# Altium project ee_453_yourname.PrjPcb
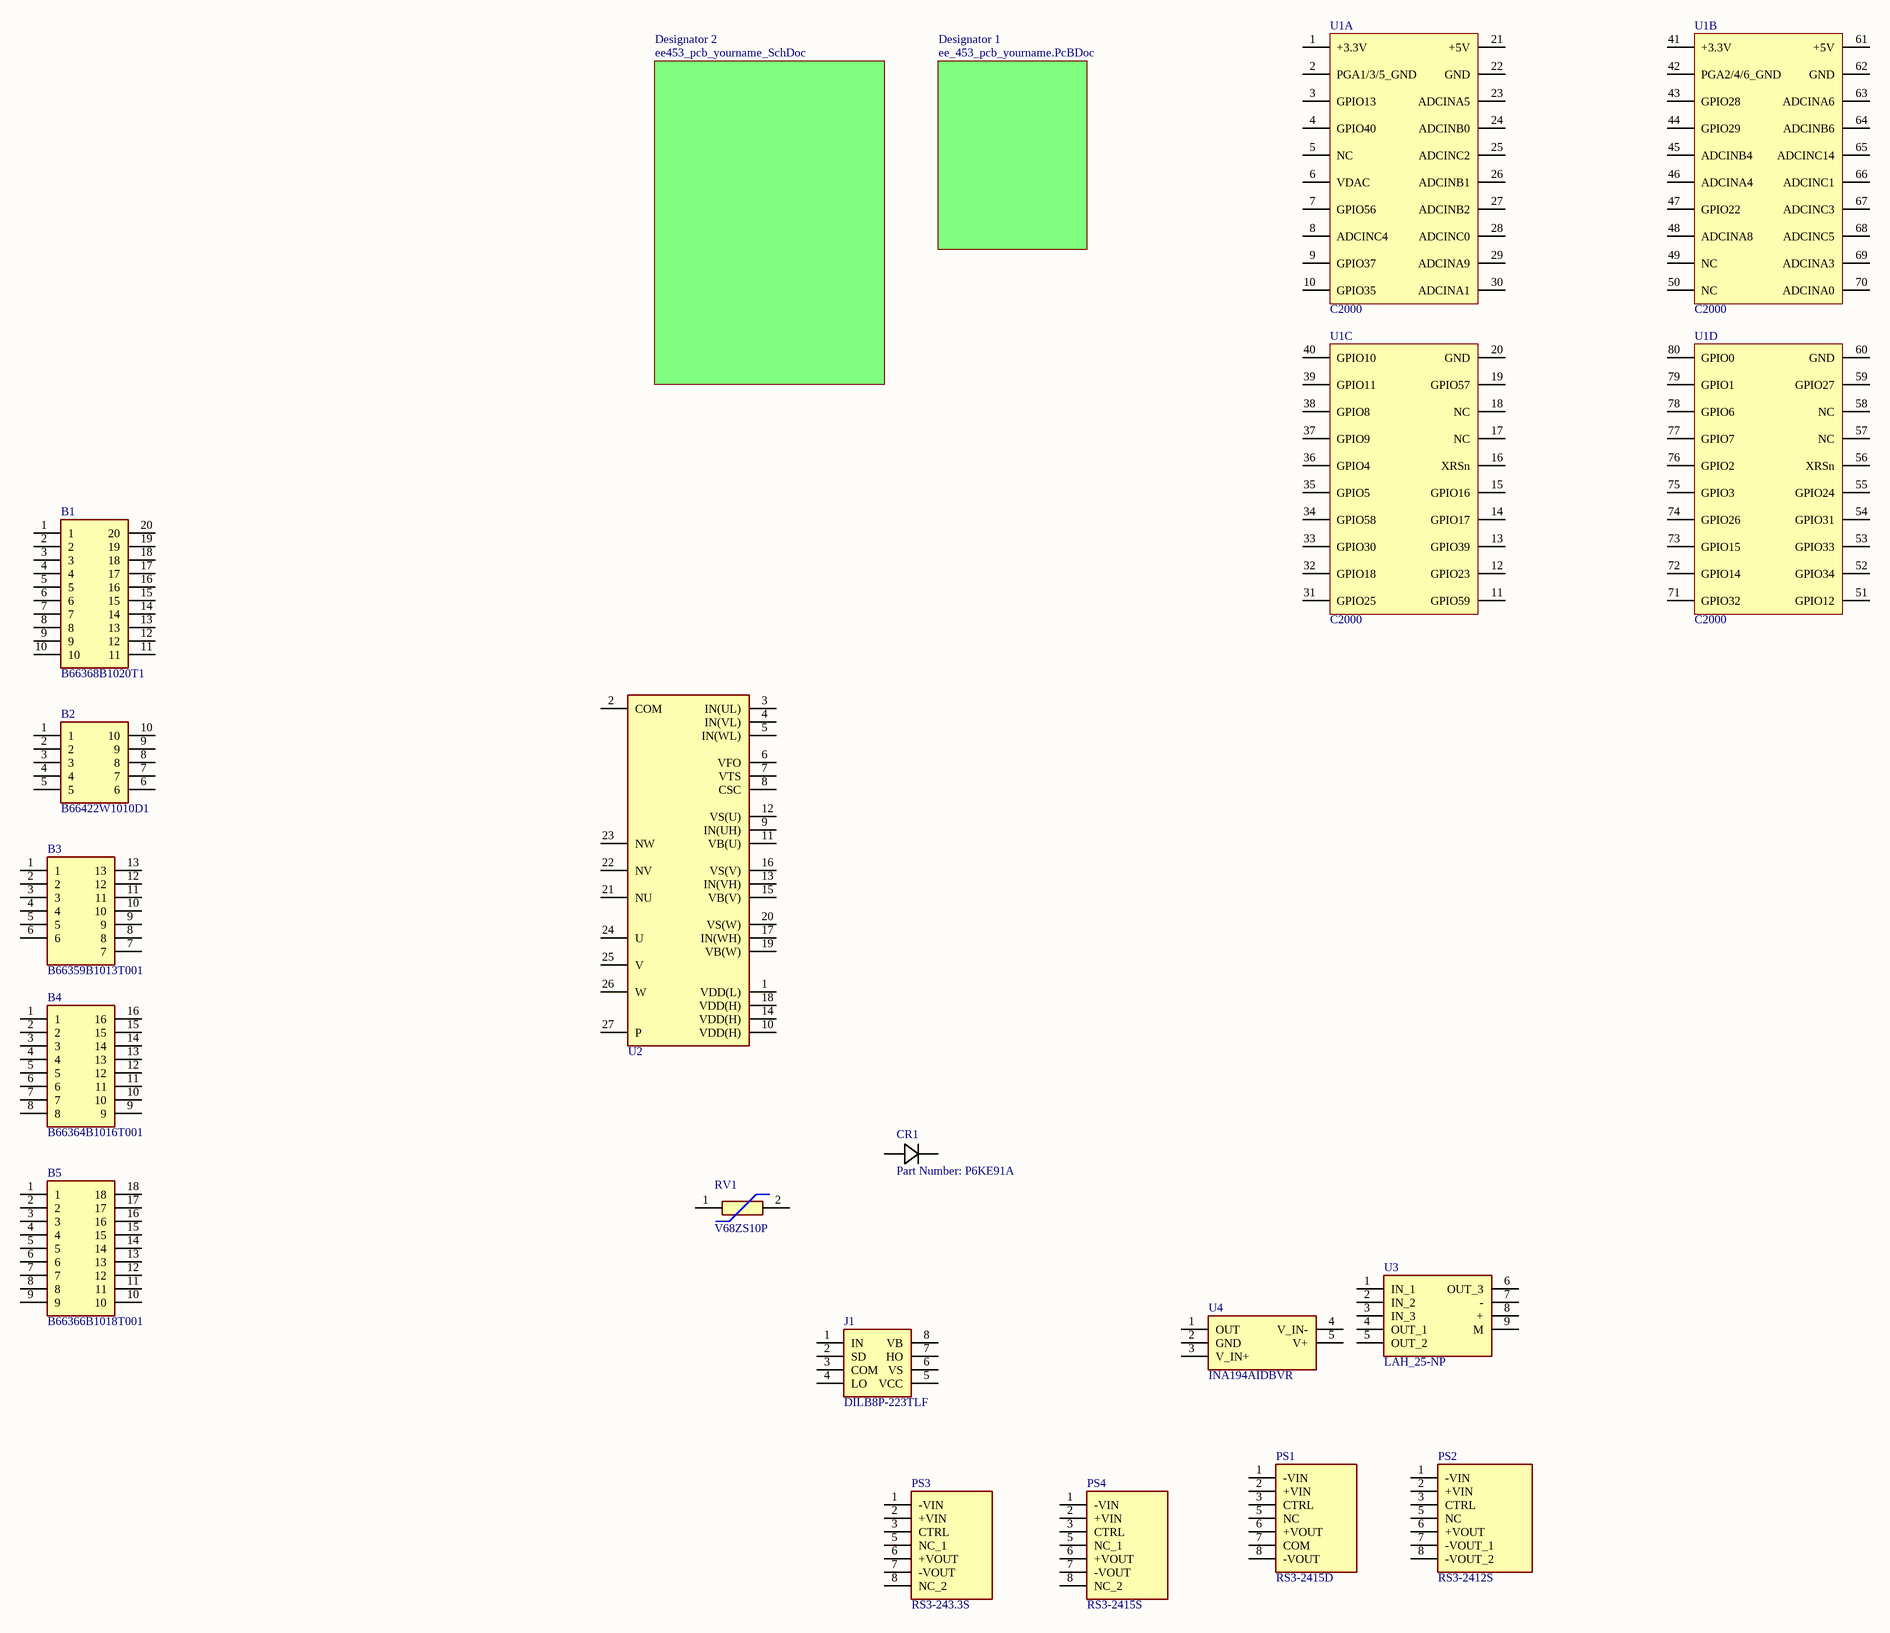
[diagram p0: ee453_pcb_yourname.SchDoc]
10 sheets, 95 parts. Net scope: hierarchical (ports join the sheet entries above them; power ports are global).
Board file: ee453_pcb_yourname.PcbDoc
Sheets:
  ee453_pcb_yourname.SchDoc
  Top_Level.SchDoc
    Power Sources = Power_Sources.SchDoc
    Current Sensor = Current_Sensor.SchDoc
    Boost Converter = Boost.SchDoc
      Inner Boost = Inner_Boost.SchDoc
    Power Module = Power_Module.SchDoc
      DSP = DSP.SchDoc
    Hall Sensors = Hall_Sensors.SchDoc
    DSP - Launchpad = DSP.SchDoc
  levelshifter_page.SchDoc

## Sheet ee453_pcb_yourname.SchDoc: EE 453 Capstone
size C; ApprovedBy: Your Name; CheckedBy: Your Name; Author: Your Name; CompanyName: Dept. of Elec. and Comp. Engg.; DrawnBy: Your Name; Engineer: Your Nmae; Organization: UW-Seattle; Address1: 185 Stevens Way; Address2: Paul Allen Center; Address3: Seattle, WA; Address4: US-98195; DocumentNumber: 1; Revision: 1.0; SheetNumber: 1; SheetTotal: 1

### Parts
(Parts that share a designator on the sheet are numbered #1, #2 ... from top to bottom, then left to right.)
B1  B66368B1020T1  [B66368B1020T1]
B2  B66422W1010D1  [B66422W1010D1]
B3  B66359B1013T001  [B66359B1013T001]
B4  B66364B1016T001  [B66364B1016T001]
B5  B66366B1018T001  [B66366B1018T001]
CR1  Part Number: P6KE91A  [P6KESeries]
J1#1  DILB8P-223TLF  [DIPS762W60P254L1016H525Q8N]
PS1#1  RS3-2415D  [RS32405DH3]
PS2#1  RS3-2412S  [RS32415S]
PS3#1  RS3-243.3S  [RS32433S]
PS4#1  RS3-2415S  [RS32415S]
RV1#1  V68ZS10P  [V68ZS10P]
U1#1  C2000  [C2000]  (parts A,B,C,D of 4)
U2  FNB34060T  [FNB34060T]  (value not drawn)
U3  LAH_25-NP  [LAH-25-NP]
U4  INA194AIDBVR  [SOT95P280X145-5N]

### Sub-sheets
Designator 1 = ee_453_pcb_yourname.PcBDoc (file not in this document): no entries
Designator 2 = ee453_pcb_yourname_SchDoc (file not in this document): no entries

### Nets

Not connected (* = marked no-connect by the designer): B1 1 2 3 4 5 6 7 8 9 10 11 12 13 14 15 16 17 18 19 20; B2 1 2 3 4 5 6 7 8 9 10; B3 1 2 3 4 5 6 7 8 9 10 11 12 13; B4 1 2 3 4 5 6 7 8 9 10 11 12 13 14 15 16; B5 1 2 3 4 5 6 7 8 9 10 11 12 13 14 15 16 17 18; CR1 1 2; J1#1 1(IN) 2(SD) 3(COM) 4(LO) 5(VCC) 6(VS) 7(HO) 8(VB); PS1#1 1(-VIN) 2(+VIN) 3(CTRL) 5(NC) 6(+VOUT) 7(COM) 8(-VOUT); PS2#1 1(-VIN) 2(+VIN) 3(CTRL) 5(NC) 6(+VOUT) 7(-VOUT_1) 8(-VOUT_2); PS3#1 1(-VIN) 2(+VIN) 3(CTRL) 5(NC_1) 6(+VOUT) 7(-VOUT) 8(NC_2); PS4#1 1(-VIN) 2(+VIN) 3(CTRL) 5(NC_1) 6(+VOUT) 7(-VOUT) 8(NC_2); RV1#1 1 2; U1#1 1(+3.3V) 2(PGA1/3/5_GND) 3(GPIO13) 4(GPIO40) 5(NC) 6(VDAC) 7(GPIO56) 8(ADCINC4) 9(GPIO37) 10(GPIO35) 11(GPIO59) 12(GPIO23) 13(GPIO39) 14(GPIO17) 15(GPIO16) 16(XRSn) 17(NC) 18(NC) 19(GPIO57) 20(GND) 21(+5V) 22(GND) 23(ADCINA5) 24(ADCINB0) 25(ADCINC2) 26(ADCINB1) 27(ADCINB2) 28(ADCINC0) 29(ADCINA9) 30(ADCINA1) 31(GPIO25) 32(GPIO18) 33(GPIO30) 34(GPIO58) 35(GPIO5) 36(GPIO4) 37(GPIO9) 38(GPIO8) 39(GPIO11) 40(GPIO10) 41(+3.3V) 42(PGA2/4/6_GND) 43(GPIO28) 44(GPIO29) 45(ADCINB4) 46(ADCINA4) 47(GPIO22) 48(ADCINA8) 49(NC) 50(NC) 51(GPIO12) 52(GPIO34) 53(GPIO33) 54(GPIO31) 55(GPIO24) 56(XRSn) 57(NC) 58(NC) 59(GPIO27) 60(GND) 61(+5V) 62(GND) 63(ADCINA6) 64(ADCINB6) 65(ADCINC14) 66(ADCINC1) 67(ADCINC3) 68(ADCINC5) 69(ADCINA3) 70(ADCINA0) 71(GPIO32) 72(GPIO14) 73(GPIO15) 74(GPIO26) 75(GPIO3) 76(GPIO2) 77(GPIO7) 78(GPIO6) 79(GPIO1) 80(GPIO0); U2 1(VDD(L)) 2(COM) 3(IN(UL)) 4(IN(VL)) 5(IN(WL)) 6(VFO) 7(VTS) 8(CSC) 9(IN(UH)) 10(VDD(H)) 11(VB(U)) 12(VS(U)) 13(IN(VH)) 14(VDD(H)) 15(VB(V)) 16(VS(V)) 17(IN(WH)) 18(VDD(H)) 19(VB(W)) 20(VS(W)) 21(NU) 22(NV) 23(NW) 24(U) 25(V) 26(W) 27(P); U3 1(IN_1) 2(IN_2) 3(IN_3) 4(OUT_1) 5(OUT_2) 6(OUT_3) 7(-) 8(+) 9(M); U4 1(OUT) 2(GND) 3(V_IN+) 4(V_IN-) 5(V+)

### Notes on the sheet
- Title
- Size:
- Date:
- File:
- C
- Number:
- Time:
- Revision:
- Sheet
- of

### Library data of the parts
B1 = B66368B1020T1: Bobbin; Manufacturer_Name: EPCOS; Datasheet Link: https://componentsearchengine.com/Datasheets/1/B66368B1020T1.pdf; Height: 40.9mm; Mouser2 Part Number: 871-B66368B1020T1; Mouser2 Price/Stock: https://www.mouser.com/Search/Refine.aspx?Keyword=871-B66368B1020T1; Manufacturer_Part_Number: B66368B1020T1
B2 = B66422W1010D1: Bobbin; Manufacturer_Name: EPCOS; Datasheet Link: https://componentsearchengine.com/Datasheets/1/B66422W1010D1.pdf; Height: 12mm; Mouser2 Part Number: 871-B66422W1010D1; Mouser2 Price/Stock: https://www.mouser.com/Search/Refine.aspx?Keyword=871-B66422W1010D1; Manufacturer_Part_Number: B66422W1010D1
B3 = B66359B1013T001: Bobbin; Manufacturer_Name: EPCOS; Datasheet Link: https://componentsearchengine.com/Datasheets/1/B66359B1013T001.pdf; Height: 25mm; Mouser2 Part Number: 871-B66359B1013T001; Mouser2 Price/Stock: https://www.mouser.com/Search/Refine.aspx?Keyword=871-B66359B1013T001; Manufacturer_Part_Number: B66359B1013T001
B4 = B66364B1016T001: Bobbin; Manufacturer_Name: EPCOS; Datasheet Link: https://componentsearchengine.com/Datasheets/1/B66364B1016T001.pdf; Height: 35.5mm; Mouser2 Part Number: 871-B66364B1016T001; Mouser2 Price/Stock: https://www.mouser.com/Search/Refine.aspx?Keyword=871-B66364B1016T001; Manufacturer_Part_Number: B66364B1016T001
B5 = B66366B1018T001: Bobbin; Manufacturer_Name: EPCOS; Datasheet Link: http://uk.rs-online.com/web/p/products/1620179; Height: 38.4mm; Manufacturer_Part_Number: B66366B1018T001; RS Part Number: 1620179; RS Price/Stock: http://uk.rs-online.com/web/p/products/1620179
CR1 = P6KE91A: No Description Available; Vendor: Littelfuse Inc; Built_By: EMA_UL_Team; Type: DEV; Manufacturer_Part_Number: P6KE91A; Copyright: Copyright (C) 2018 Accelerated Designs. All rights reserved; RefDes: RefDes; Value: Value
J1#1 = DILB8P-223TLF: Connector; Manufacturer_Name: Amphenol; Datasheet Link: https://componentsearchengine.com/Datasheets/1/DILB8P-223TLF.pdf; Height: 5.25mm; Mouser2 Part Number: 649-DILB8P223TLF; Mouser2 Price/Stock: https://www.mouser.com/Search/Refine.aspx?Keyword=649-DILB8P223TLF; Manufacturer_Part_Number: DILB8P-223TLF
PS1#1 = RS3-2415D: Power Supply; Manufacturer_Name: RECOM Power; Allied_Number: 70052275; Datasheet Link: https://www.recom-power.com/pdf/Econoline/RS3-S_D_Z.pdf; Height: 11.35mm; Manufacturer_Part_Number: RS3-2415D; Mouser Part Number: 919-RS3-2415D; Mouser Price/Stock: https://www.mouser.com/Search/Refine.aspx?Keyword=919-RS3-2415D; RS Part Number: 1669089; RS Price/Stock: https://uk.rs-online.com/web/p/products/1669089; Allied Price/Stock: https://www.alliedelec.com/recom-power-inc-rs3-2415d/70052275/
PS2#1 = RS3-2412S: Power Supply; Manufacturer_Name: RECOM Power; Datasheet Link: https://www.recom-power.com/pdf/Econoline/RS3-S_D_Z.pdf; Manufacturer_Part_Number: RS3-2412S; Mouser Part Number: 919-RS3-2412S; Mouser Price/Stock: https://www.mouser.com/Search/Refine.aspx?Keyword=919-RS3-2412S; RS Part Number: 1669097; RS Price/Stock: https://uk.rs-online.com/web/p/products/1669097
PS3#1 = RS3-243.3S: Power Supply; Manufacturer_Name: RECOM Power; Datasheet Link: https://www.arrow.com/en/products/rs3-243.3s/recom-power; Height: 11.35mm; Manufacturer_Part_Number: RS3-243.3S; Mouser Part Number: 919-RS3-243.3S; Mouser Price/Stock: https://www.mouser.com/Search/Refine.aspx?Keyword=919-RS3-243.3S; RS Part Number: 0163748P; RS Price/Stock: http://uk.rs-online.com/web/p/products/0163748P
PS4#1 = RS3-2415S: Power Supply; Manufacturer_Name: RECOM Power; Datasheet Link: https://www.recom-power.com/pdf/Econoline/RS3-S_D_Z.pdf; Height: 11.35mm; Manufacturer_Part_Number: RS3-2415S; Mouser Part Number: 919-RS3-2415S; Mouser Price/Stock: https://www.mouser.com/Search/Refine.aspx?Keyword=919-RS3-2415S
RV1#1 = V68ZS10P: Varistor; Manufacturer_Name: LITTELFUSE; Datasheet Link: http://www.littelfuse.com/~/media/electronics/datasheets/varistors/littelfuse_varistor_za_datasheet.pdf.pdf; Height: 20mm; Manufacturer_Part_Number: V68ZS10P
U1#1 = C2000: F280049C; Parameter 1: test 2
U3 = LAH_25-NP: Integrated Circuit; Manufacturer_Name: LEM; Manufacturer_Part_Number: LAH 25-NP; Datasheet Link: http://www.lem.com/docs/products/lah_25-np.pdf
U4 = INA194AIDBVR: Integrated Circuit; Manufacturer_Name: Texas Instruments; Datasheet Link: http://www.ti.com/lit/gpn/ina194; Height: 1.45mm; Manufacturer_Part_Number: INA194AIDBVR

## Sheet Top_Level.SchDoc
size A
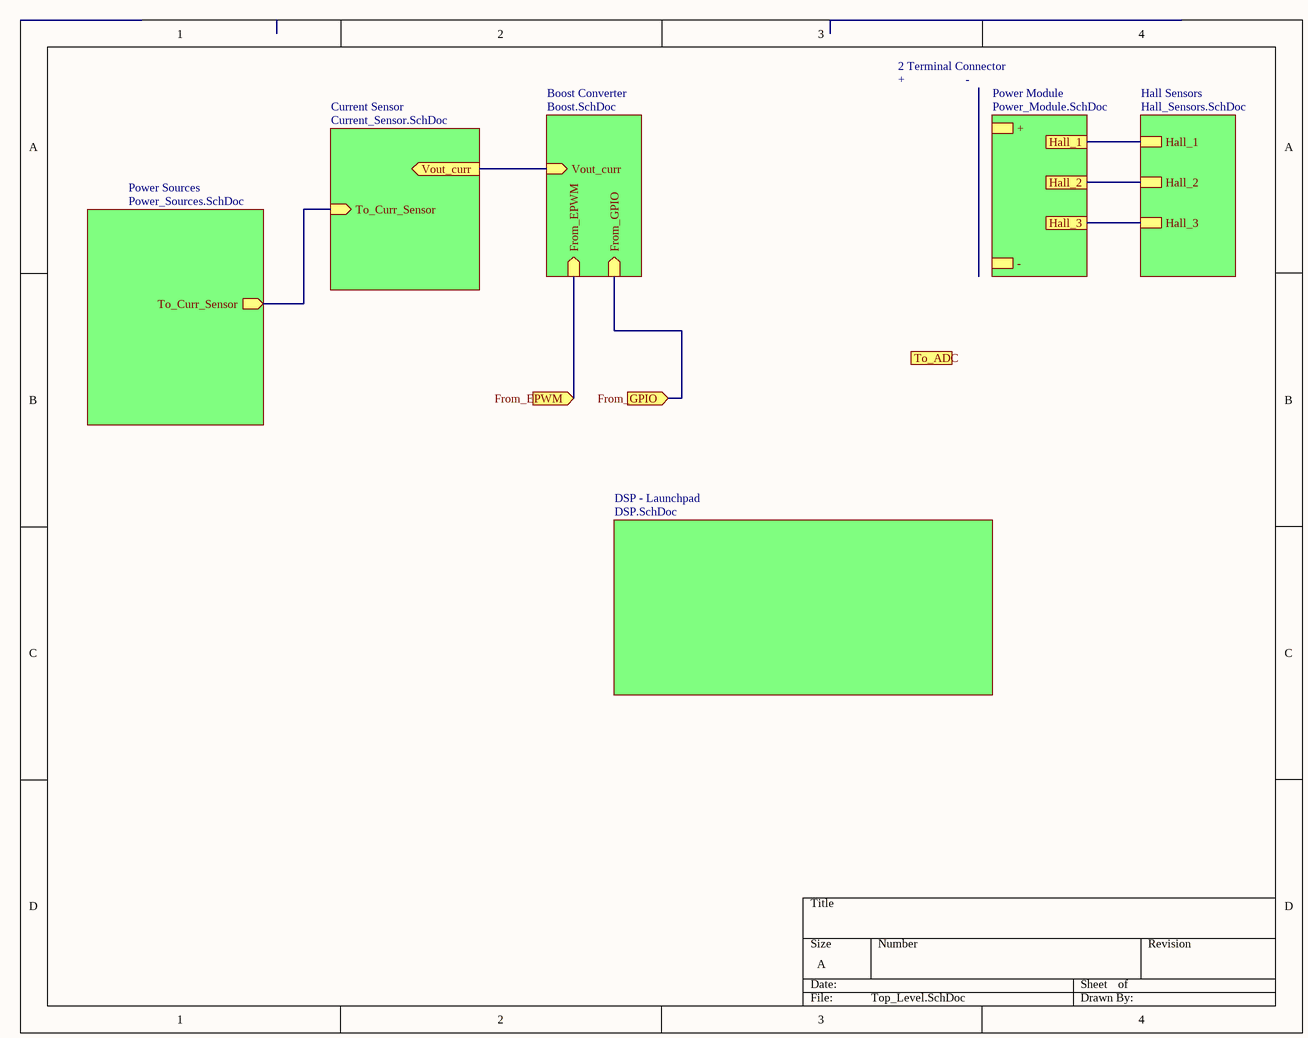
[diagram p1: Top_Level.SchDoc]

### Sub-sheets
Boost Converter = Boost.SchDoc: From_EPWM (in), From_GPIO (in), Vout_curr (in)
Current Sensor = Current_Sensor.SchDoc: To_Curr_Sensor (in)
DSP - Launchpad = DSP.SchDoc: no entries
Hall Sensors = Hall_Sensors.SchDoc: Hall_1, Hall_2, Hall_3
Power Module = Power_Module.SchDoc: +, -
Power Sources = Power_Sources.SchDoc: To_Curr_Sensor (out)

### Ports
From_EPWM (in), From_GPIO (in), Hall_1, Hall_2, Hall_3, To_ADC (out), Vout_curr (out)

### Nets
NetCdc1_1: sheet Power Sources/To_Curr_Sensor, sheet Current Sensor/To_Curr_Sensor
NetInductor_9: port Vout_curr, sheet Boost Converter/Vout_curr
NetJ?_1: port From_EPWM, sheet Boost Converter/From_EPWM
(unnamed): port Hall_1, sheet Hall Sensors/Hall_1
(unnamed): port Hall_2, sheet Hall Sensors/Hall_2
(unnamed): port Hall_3, sheet Hall Sensors/Hall_3
(unnamed): port From_GPIO, sheet Boost Converter/From_GPIO

### Notes on the sheet
- 2 Terminal Connector
- +
- -

## Sheet Power_Sources.SchDoc
size A
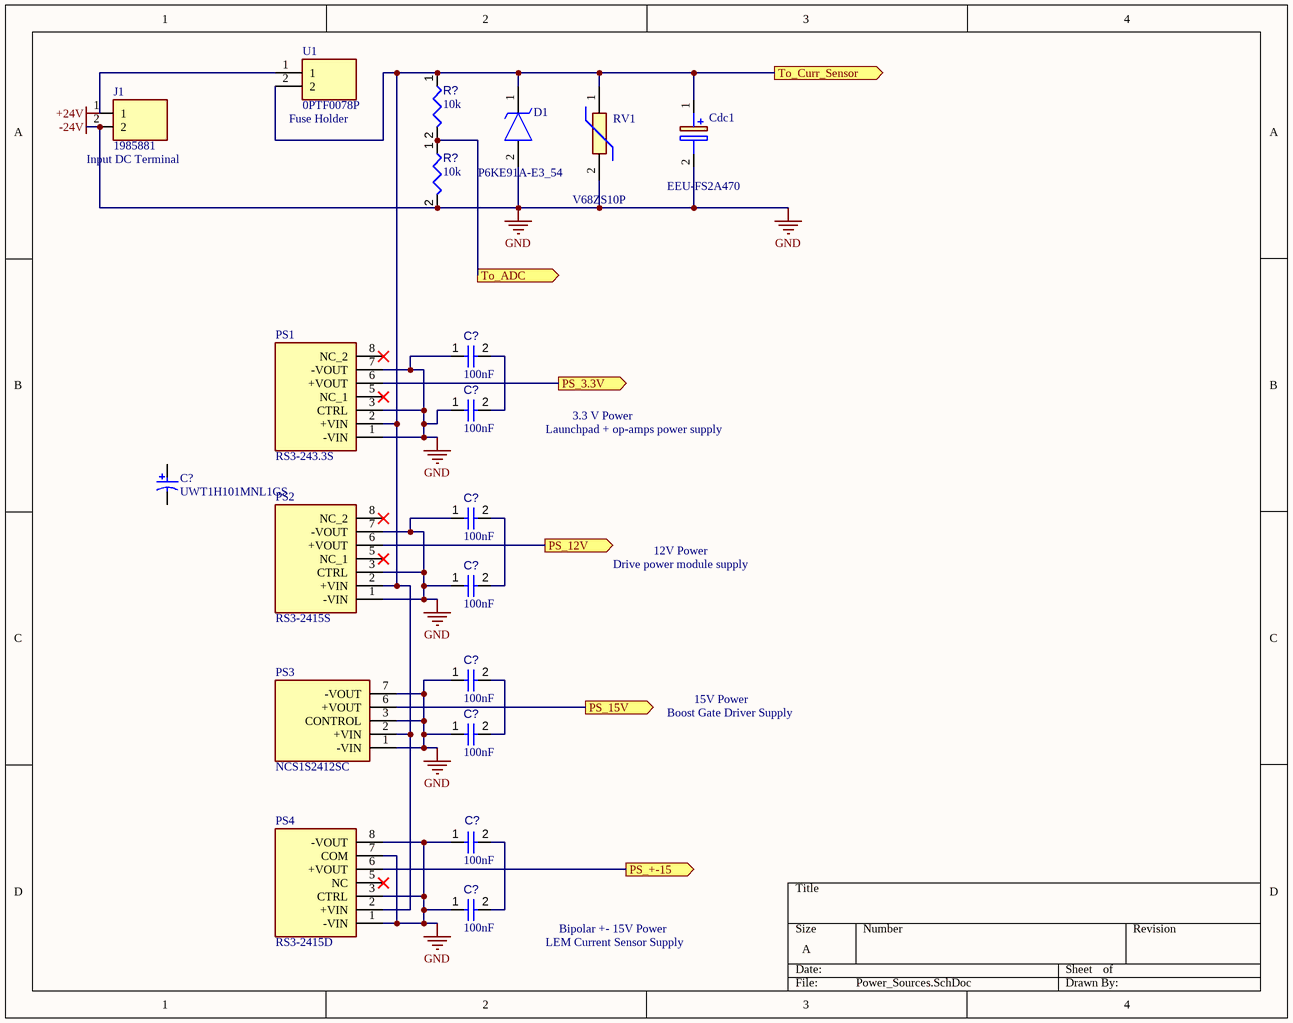
[diagram p2: Power_Sources.SchDoc]

### Parts
(Parts that share a designator on the sheet are numbered #1, #2 ... from top to bottom, then left to right.)
C?#1  value 100nF  [CAPC0402(1005)60_L]  (hidden comment: Capacitor 100nF +/-20% 50V 0402)
C?#2  value 100nF  [CAPC0402(1005)60_L]  (hidden comment: Capacitor 100nF +/-20% 50V 0402)
C?#3  UWT1H101MNL1GS  [NIC-UWT1H101MNL1GS_L]
C?#4  value 100nF  [CAPC0402(1005)60_L]  (hidden comment: Capacitor 100nF +/-20% 50V 0402)
C?#5  value 100nF  [CAPC0402(1005)60_L]  (hidden comment: Capacitor 100nF +/-20% 50V 0402)
C?#6  value 100nF  [CAPC0402(1005)60_L]  (hidden comment: Capacitor 100nF +/-20% 50V 0402)
C?#7  value 100nF  [CAPC0402(1005)60_L]  (hidden comment: Capacitor 100nF +/-20% 50V 0402)
C?#8  value 100nF  [CAPC0402(1005)60_L]  (hidden comment: Capacitor 100nF +/-20% 50V 0402)
C?#9  value 100nF  [CAPC0402(1005)60_L]  (hidden comment: Capacitor 100nF +/-20% 50V 0402)
Cdc1  EEU-FS2A470  [CAPPRD350W65D800H1650]
D1  P6KE91A-E3_54  [DIOAD1910W86L670D310]
J1#2  1985881  [1985881]
PS1#2  RS3-243.3S  [RS32433S]
PS2#2  RS3-2415S  [RS32415S]
PS3#2  NCS1S2412SC  [NCS1S2412SC]
PS4#2  RS3-2415D  [RS32405DH3]
R?#1  value 10k  [RESC1608X55X25ML10T15]  (hidden comment: Resistor 10k +/-1% 0603 100 mW)
R?#2  value 10k  [RESC1608X55X25ML10T15]  (hidden comment: Resistor 10k +/-1% 0603 100 mW)
RV1#2  V68ZS10P  [V68ZS10P]
U1#2  0PTF0078P  [0PTF0078P]

### Ports
PS_3.3V (out), PS_12V (out), PS_15V (out), PS_+-15 (out), To_ADC (out), To_Curr_Sensor (out)

### Nets
+24V: U1#2.1
-24V: C?#1.1 C?#2.1 C?#4.1 C?#5.1 C?#6.1 C?#7.1 C?#8.1 C?#9.1 Cdc1.2(-) D1.2(A) J1#2.2 PS1#2.1(-VIN) PS1#2.3(CTRL) PS1#2.7(-VOUT) PS2#2.1(-VIN) PS2#2.3(CTRL) PS2#2.7(-VOUT) PS3#2.1(-VIN) PS3#2.3(CONTROL) PS3#2.7(-VOUT) PS4#2.1(-VIN) PS4#2.3(CTRL) PS4#2.7(COM) PS4#2.8(-VOUT) R?#2.2 RV1#2.2  [also labelled GND]
NetC?#1_2: C?#1.2 C?#2.2
NetC?#4_2: C?#4.2 C?#5.2
NetC?#6_2: C?#6.2 C?#7.2
NetC?#8_2: C?#8.2 C?#9.2
NetCdc1_1: Cdc1.1(+) D1.1(K) PS1#2.2(+VIN) PS2#2.2(+VIN) PS3#2.2(+VIN) PS4#2.2(+VIN) R?#1.1 RV1#2.1 U1#2.2 ; port To_Curr_Sensor
NetPS1#2_6: PS1#2.6(+VOUT) ; port PS_3.3V
NetPS2#2_6: PS2#2.6(+VOUT) ; port PS_12V
NetPS3#2_6: PS3#2.6(+VOUT) ; port PS_15V
NetPS4#2_6: PS4#2.6(+VOUT) ; port PS_+-15
NetR?#1_2: R?#1.2 R?#2.1 ; port To_ADC

Not connected (* = marked no-connect by the designer): C?#3 1 2; J1#2 1; PS1#2 5(NC_1)* 8(NC_2)*; PS2#2 5(NC_1)* 8(NC_2)*; PS4#2 5(NC)*

### Notes on the sheet
- (near J1#2) Input DC Terminal
- (near U1#2) Fuse Holder
- Launchpad + op-amps power supply
- 3.3 V Power
- Drive power module supply
- 12V Power
- 15V Power
- Boost Gate Driver Supply
- LEM Current Sensor Supply
- Bipolar +- 15V Power

### Library data of the parts
C?#1 C?#2 C?#4-C?#9 = CMP-001-00067-3: Chip Capacitor, 100nF +/-20%, 50V, 0402, Thickness 0.6 mm; Tolerance: 10%; Min Operating Temperature: -55°C; Pins: 2; Case/Package: 0402; Max Operating Temperature: 85°C; Voltage Rating: 50V; Mounting Technology: SMT
C?#3 = CMP-2000-07373-1: Aluminum Electrolytic Capacitor, 100 uF, +/- 20%, 50 V, -55 to 105 degC, 2-Pin SMD, RoHS, Tape and Reel; Manufacturer: Nichicon; Capacitance: 100µF; Type: Can; Rated Voltage: 50V; Datasheet Version: 08/2015; Operating Temp-Max: 105°C; Mounting Technology: SurfaceMount; Datasheet URL: http://products.nichicon.co.jp/en/pdf/XJA043/e-uwt.pdf; Package Description: Aluminum Electrolytic Capacitor, Body 8.3 x 8.3 mm, Height 10.8 mm; Package Reference: UWT1H101MNL1GS; Case Size/Dimension: Ø8x10mm; Manufacturer URL: http://www.nichicon.co.jp/english/
Cdc1 = EEU-FS2A470: Capacitor Polarised; Manufacturer_Name: Panasonic; Datasheet Link: https://componentsearchengine.com/Datasheets/1/EEU-FS2A470.pdf; Height: 16.5mm; Manufacturer_Part_Number: EEU-FS2A470; Mouser Part Number: 667-EEU-FS2A470; Mouser Price/Stock: https://www.mouser.co.uk/ProductDetail/Panasonic/EEU-FS2A470?qs=w%2Fv1CP2dgqrDlaRaE647gA%3D%3D; Arrow Part Number: EEU-FS2A470; Arrow Price/Stock: https://www.arrow.com/en/products/eeu-fs2a470/panasonic
D1 = P6KE91A-E3_54: TVS Diode (Uni-directional); Manufacturer_Name: Vishay; Manufacturer_Part_Number: P6KE91A-E3/54; Datasheet Link: https://www.mouser.com/datasheet/2/427/p6ke-1767850.pdf
J1#2 = 1985881: Connector; Manufacturer_Name: Phoenix Contact; Datasheet Link: https://www.digikey.com/en/products/detail/phoenix-contact/1985881/2511015; Height: 13.9mm; Manufacturer_Part_Number: 1985881
PS1#2 = RS3-243.3S: as PS3#1 on sheet ee453_pcb_yourname; Datasheet Link: https://www.arrow.com/en/products/rs3-243.3s/recom-power; Height: 11.35mm; Manufacturer_Part_Number: RS3-243.3S; Mouser Part Number: 919-RS3-243.3S; Mouser Price/Stock: https://www.mouser.com/Search/Refine.aspx?Keyword=919-RS3-243.3S; Arrow Part Number: RS3-243.3S; Arrow Price/Stock: https://www.arrow.com/en/products/rs3-243.3s/recom-power
PS2#2 = RS3-2415S: as PS4#1 on sheet ee453_pcb_yourname; Datasheet Link: https://www.recom-power.com/pdf/Econoline/RS3-S_D_Z.pdf; Height: 11.35mm; Manufacturer_Part_Number: RS3-2415S; Mouser Part Number: 919-RS3-2415S; Mouser Price/Stock: https://www.mouser.com/Search/Refine.aspx?Keyword=919-RS3-2415S
PS3#2 = NCS1S2412SC: Power Supply; Manufacturer_Name: Murata Electronics; Datasheet Link: https://power.murata.com/data/power/ncl/kdc_ncs1.pdf; Height: 11.3mm; Manufacturer_Part_Number: NCS1S2412SC; Mouser Part Number: 580-NCS1S2412SC; Mouser Price/Stock: https://www.mouser.com/Search/Refine.aspx?Keyword=580-NCS1S2412SC; Arrow Part Number: NCS1S2412SC; Arrow Price/Stock: https://www.arrow.com/en/products/ncs1s2412sc/murata-power-solutions
PS4#2 = RS3-2415D: as PS1#1 on sheet ee453_pcb_yourname; Datasheet Link: https://www.recom-power.com/pdf/Econoline/RS3-S_D_Z.pdf; Height: 11.35mm; Manufacturer_Part_Number: RS3-2415D; Mouser Part Number: 919-RS3-2415D; Mouser Price/Stock: https://www.mouser.com/Search/Refine.aspx?Keyword=919-RS3-2415D; RS Part Number: 1669089; RS Price/Stock: https://uk.rs-online.com/web/p/products/1669089; Allied Price/Stock: https://www.alliedelec.com/recom-power-inc-rs3-2415d/70052275/
R?#1 R?#2 = CMP-009-00017-5: Chip Resistor, 10 KOhm, +/- 1%, 01 W, -55 to 155 degC, 0603 (1608 Metric); Voltage Rating: 50V; Power: 100mW; RoHS Compliant: True; Min Operating Temperature: -55°C; Pins: 2; Case/Package: 0603; Mounting Technology: SM; Max Operating Temperature: 155°C; Tolerance: 1%
RV1#2 = V68ZS10P: Varistor; Manufacturer_Name: LITTELFUSE; Datasheet Link: http://www.littelfuse.com/~/media/electronics/datasheets/varistors/littelfuse_varistor_za_datasheet.pdf.pdf; Height: 20mm; Manufacturer_Part_Number: V68ZS10P; Mouser Part Number: 576-V68ZS10P; Mouser Price/Stock: https://www.mouser.co.uk/ProductDetail/Littelfuse/V68ZS10P?qs=1%2FWRN91BpNvIRlTsONWDiQ%3D%3D
U1#2 = 0PTF0078P: Undefined or Miscellaneous; Manufacturer_Name: LITTELFUSE; Datasheet Link: https://media.digikey.com/pdf/Data%20Sheets/Littelfuse%20PDFs/PTF075_77_78.pdf; Height: 11.5mm; Manufacturer_Part_Number: 0PTF0078P; Mouser Part Number: 576-0PTF0078P; Mouser Price/Stock: https://www.mouser.co.uk/ProductDetail/Littelfuse/0PTF0078P?qs=Co4VkB5J4%2Fsczy6gG8s%2FsA%3D%3D; Arrow Part Number: 0PTF0078P; Arrow Price/Stock: https://www.arrow.com/en/products/0ptf0078p/littelfuse

## Sheet Current_Sensor.SchDoc
size A
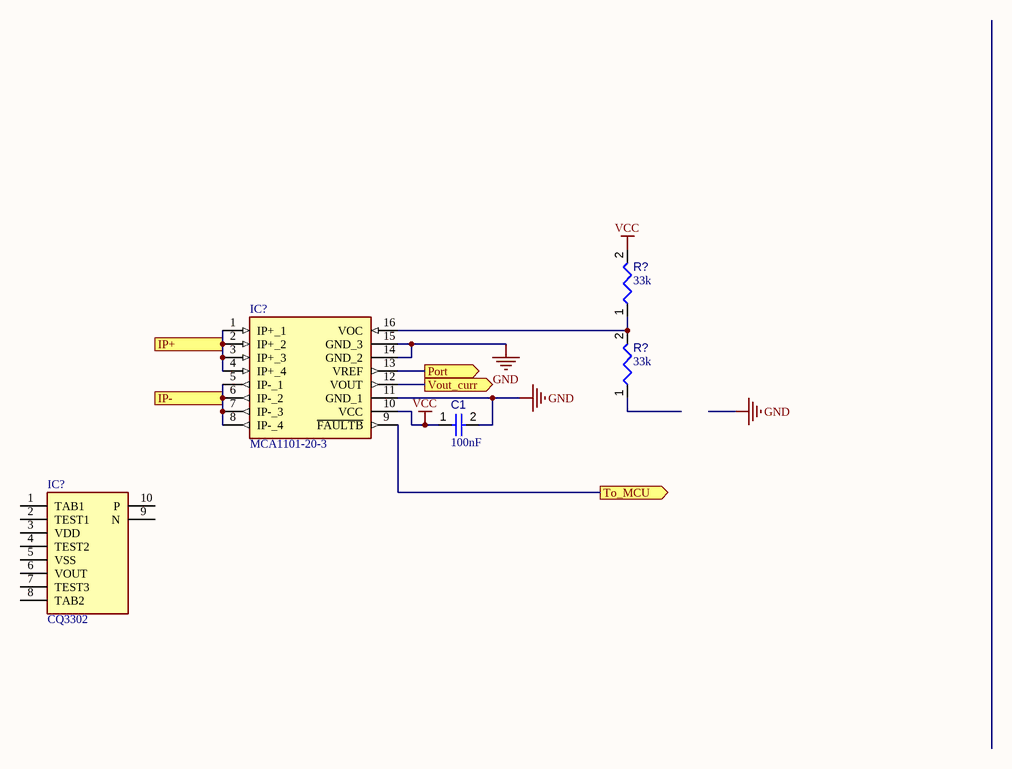
[diagram p3: Current_Sensor.SchDoc]

### Parts
(Parts that share a designator on the sheet are numbered #1, #2 ... from top to bottom, then left to right.)
C1#1  value 100nF  [CAPC0402(1005)60_L]  (hidden comment: Capacitor 100nF +/-20% 50V 0402)
IC?#1  MCA1101-20-3  [SOIC127P1031X264-16N]
IC?#2  CQ3302  [CQ3303]
R?#3  value 33k  [RESC1005X40X25ML10T10]  (hidden comment: Resistor 33k +/-5% 0402 63 mW)
R?#4  value 33k  [RESC1005X40X25ML10T10]  (hidden comment: Resistor 33k +/-5% 0402 63 mW)

### Ports
IP+ (in), IP- (out), Port (out), To_MCU (out), Vout_curr (out)

### Nets
GND: C1#1.2 IC?#1.11(GND_1) IC?#1.14(GND_2) IC?#1.15(GND_3)  [project net -24V]
VCC: C1#1.1 IC?#1.10(VCC) R?#3.2
NetIC?#1_1: IC?#1.1(IP+_1) IC?#1.2(IP+_2) IC?#1.3(IP+_3) IC?#1.4(IP+_4) ; port IP+
NetIC?#1_5: IC?#1.5(IP-_1) IC?#1.6(IP-_2) IC?#1.7(IP-_3) IC?#1.8(IP-_4) ; port IP-
NetIC?#1_9: IC?#1.9(~{FAULTB}) ; port To_MCU
NetIC?#1_12: IC?#1.12(VOUT) ; port Vout_curr
NetIC?#1_13: IC?#1.13(VREF) ; port Port
NetIC?#1_16: IC?#1.16(VOC) R?#3.1 R?#4.2

Not connected (* = marked no-connect by the designer): IC?#2 1(TAB1) 2(TEST1) 3(VDD) 4(TEST2) 5(VSS) 6(VOUT) 7(TEST3) 8(TAB2) 9(N) 10(P); R?#4 1

### Library data of the parts
C1#1 = CMP-001-00067-3: as C?#1 on sheet Power_Sources; Min Operating Temperature: -55°C; Pins: 2; Case/Package: 0402; Max Operating Temperature: 85°C; Voltage Rating: 50V; Mounting Technology: SMT
IC?#1 = MCA1101-20-3: Integrated Circuit; Manufacturer_Name: ACEINNA; Datasheet Link: https://componentsearchengine.com/Datasheets/34/MCA1101-20-3.pdf; Height: 2.64mm; Manufacturer_Part_Number: MCA1101-20-3; Mouser Part Number: 438-MCA1101-20-3; Mouser Price/Stock: https://www.mouser.co.uk/ProductDetail/ACEINNA/MCA1101-20-3?qs=PzGy0jfpSMs8efb76nV%2FyQ%3D%3D
IC?#2 = CQ3302: Integrated Circuit; Manufacturer_Name: AKM; Datasheet Link: http://www.akm.com/akm/en/file/datasheet/CQ-3302.pdf; Height: 1.4mm; Manufacturer_Part_Number: CQ3302
R?#3 R?#4 = CMP-009-00028-5: Chip Resistor, 33 KOhm, +/- 5%, 0.063 W, -55 to 155 degC, 0402 (1005 Metric); Power: 63mW; Tolerance: 5%; Case/Package: 0402; Mounting Technology: SM; Min Operating Temperature: -55°C; Max Operating Temperature: 155°C; Pins: 2; RoHS Compliant: True

## Sheet Boost.SchDoc
size A
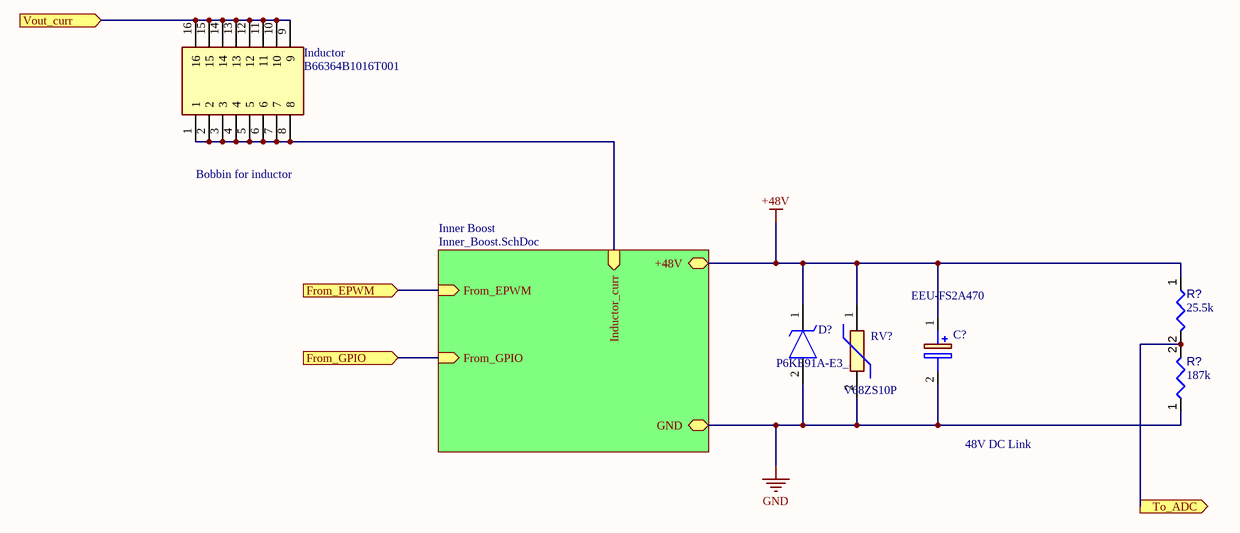
[diagram p4: Boost.SchDoc]

### Parts
(Parts that share a designator on the sheet are numbered #1, #2 ... from top to bottom, then left to right.)
C?#10  EEU-FS2A470  [CAPPRD350W65D800H1650]
D?  P6KE91A-E3_54  [DIOAD1910W86L670D310]
Inductor  B66364B1016T001  [B66364B1016T001]
R?#5  value 25.5k  [RESC0402(1005)_L]  (hidden comment: Resistor 25K5 +/-1 % 0402 63 mW)
R?#6  value 187k  [RESC0402(1005)_L]  (hidden comment: Resistor 187K +/-1 % 0402 63 mW)
RV?  V68ZS10P  [V68ZS10P]

### Sub-sheets
Inner Boost = Inner_Boost.SchDoc: From_EPWM (in), From_GPIO (in), Inductor_curr (in), GND (bidir), +48V (bidir)

### Ports
From_EPWM (in), From_GPIO (in), To_ADC (out), Vout_curr (in)

### Nets
+48V: C?#10.1(+) D?.1(K) R?#5.1 RV?.1 ; sheet Inner Boost/+48V
GND: C?#10.2(-) D?.2(A) R?#6.1 RV?.2 ; sheet Inner Boost/GND  [project net -24V]
NetInductor_1: Inductor.1 Inductor.2 Inductor.3 Inductor.4 Inductor.5 Inductor.6 Inductor.7 Inductor.8 ; sheet Inner Boost/Inductor_curr
NetInductor_9: Inductor.9 Inductor.10 Inductor.11 Inductor.12 Inductor.13 Inductor.14 Inductor.15 Inductor.16 ; port Vout_curr
NetJ?_1: port From_EPWM, sheet Inner Boost/From_EPWM
NetR?#5_2: R?#5.2 R?#6.2 ; port To_ADC
(unnamed): port From_GPIO, sheet Inner Boost/From_GPIO

### Notes on the sheet
- Bobbin for inductor
- 48V DC Link

### Library data of the parts
C?#10 = EEU-FS2A470: as Cdc1 on sheet Power_Sources; Datasheet Link: https://componentsearchengine.com/Datasheets/1/EEU-FS2A470.pdf; Height: 16.5mm; Manufacturer_Part_Number: EEU-FS2A470; Mouser Part Number: 667-EEU-FS2A470; Mouser Price/Stock: https://www.mouser.co.uk/ProductDetail/Panasonic/EEU-FS2A470?qs=w%2Fv1CP2dgqrDlaRaE647gA%3D%3D; Arrow Part Number: EEU-FS2A470; Arrow Price/Stock: https://www.arrow.com/en/products/eeu-fs2a470/panasonic
D? = P6KE91A-E3_54: as D1 on sheet Power_Sources; Datasheet Link: https://www.mouser.com/datasheet/2/427/p6ke-1767850.pdf
Inductor = B66364B1016T001: Undefined or Miscellaneous; Manufacturer_Name: TDK; Datasheet Link: https://www.mouser.com/datasheet/2/400/etd_39_20_13-1527806.pdf; Height: 35.5mm; Manufacturer_Part_Number: B66364B1016T001; Mouser Part Number: 871-B66364B1016T001; Mouser Price/Stock: https://www.mouser.co.uk/ProductDetail/EPCOS-TDK/B66364B1016T001/?qs=w5o0Loj0u7OCD3bXX%252BmaPQ%3D%3D; Arrow Part Number: B66364B1016T001; Arrow Price/Stock: https://www.arrow.com/en/products/b66364b1016t001/epcos-tdk
R?#5 = CMP-009-00171-3: Chip Resistor, 25,5 kOhms, +/-1 %, 63 mW, -55 to 155 degC, 0402; Tolerance: 1%; Power: 63mW; Case/Package: 0402; Min Operating Temperature: -55°C; Max Operating Temperature: 155°C; Pins: 2
R?#6 = CMP-009-00170-3: Chip Resistor, 187 kOhms, +/-1 %, 63 mW, -55 to 155 degC, 0402; Power: 63mW; Tolerance: 1%; Case/Package: 0402; Min Operating Temperature: -55°C; Pins: 2; Max Operating Temperature: 155°C
RV? = V68ZS10P: Varistor; Manufacturer_Name: LITTELFUSE; Datasheet Link: http://www.littelfuse.com/~/media/electronics/datasheets/varistors/littelfuse_varistor_za_datasheet.pdf.pdf; Height: 20mm; Manufacturer_Part_Number: V68ZS10P; Mouser Part Number: 576-V68ZS10P; Mouser Price/Stock: https://www.mouser.co.uk/ProductDetail/Littelfuse/V68ZS10P?qs=1%2FWRN91BpNvIRlTsONWDiQ%3D%3D

## Sheet Inner_Boost.SchDoc
size A
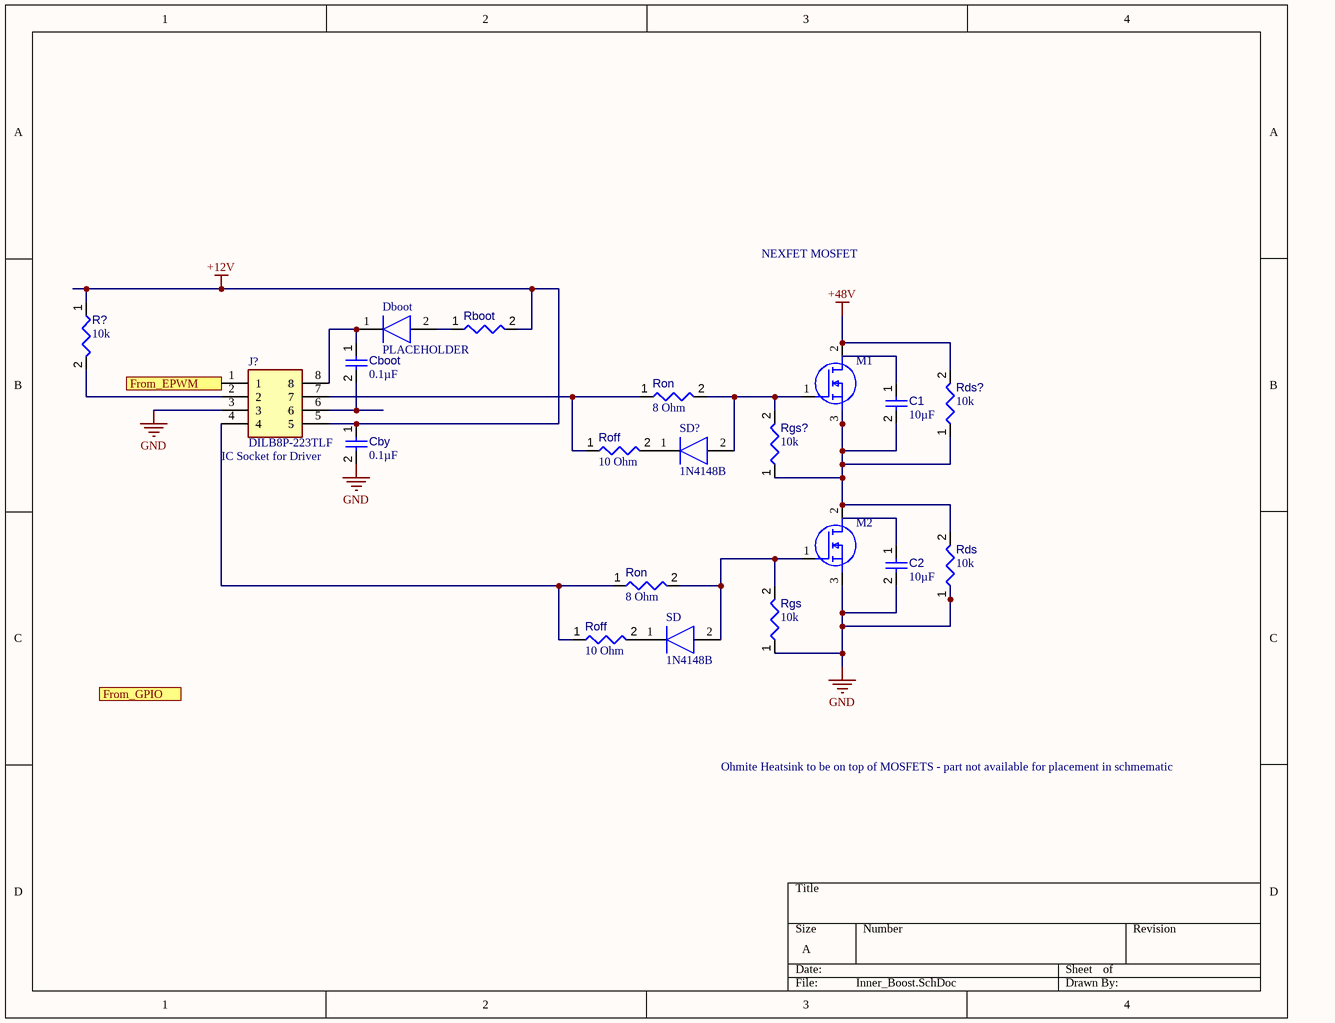
[diagram p5: Inner_Boost.SchDoc]

### Parts
(Parts that share a designator on the sheet are numbered #1, #2 ... from top to bottom, then left to right.)
C1#2  value 10µF  [CAPC0805(2012)145_L]  (hidden comment: Capacitor 10µF +/-20% 25V 0805)
C2#1  value 10µF  [CAPC0805(2012)145_L]  (hidden comment: Capacitor 10µF +/-20% 25V 0805)
Cboot  value 0.1µF  [CAPC1005X56X25LL10T15]  (hidden comment: Capacitor 0.1 uF +/- 5% 16 V 0402)
Cby  value 0.1µF  [CAPC1005X56X25LL10T15]  (hidden comment: Capacitor 0.1 uF +/- 5% 16 V 0402)
Dboot  PLACEHOLDER  [DIOAD990W55L340D162]
J?  DILB8P-223TLF  [DIPS762W60P254L1016H525Q8N]
M1  IRFB4615PBF  [TO254P483X1016X1994-3P]  (value not drawn)
M2  IRFB4615PBF  [TO254P483X1016X1994-3P]  (value not drawn)
R?#7  value 10k  [RESC0402(1005)_L]  (hidden comment: Resistor 10K  +/-1 % 0402 63 mW)
Rboot  Resistor 10k +/-1% 0603 100 mW  [RESC1608X55X25ML10T15]  (value not drawn)
Rds  value 10k  [RESC0402(1005)_L]  (hidden comment: Resistor 10K  +/-1 % 0402 63 mW)
Rds?  value 10k  [RESC0402(1005)_L]  (hidden comment: Resistor 10K  +/-1 % 0402 63 mW)
Rgs  value 10k  [RESC0402(1005)_L]  (hidden comment: Resistor 10K  +/-1 % 0402 63 mW)
Rgs?  value 10k  [RESC0402(1005)_L]  (hidden comment: Resistor 10K  +/-1 % 0402 63 mW)
Roff#1  value 10 Ohm  [RESC1608X55X25ML10T15]  (hidden comment: Resistor 10k +/-1% 0603 100 mW)
Roff#2  value 10 Ohm  [RESC1608X55X25ML10T15]  (hidden comment: Resistor 10k +/-1% 0603 100 mW)
Ron#1  value 8 Ohm  [RESC1608X55X25ML10T15]  (hidden comment: Resistor 10k +/-1% 0603 100 mW)
Ron#2  value 8 Ohm  [RESC1608X55X25ML10T15]  (hidden comment: Resistor 10k +/-1% 0603 100 mW)
SD  1N4148B  [DIOAD990W55L340D162]
SD?  1N4148B  [DIOAD990W55L340D162]

### Ports
From_EPWM (in), From_GPIO

### Nets
+12V: Cby.1 J?.5 R?#7.1 Rboot.2
+48V: M1.2(D) Rds?.2
GND: C2#1.2 Cby.2 J?.3 M2.3(S) Rds.1 Rgs.1  [project net -24V]
NetC1#2_2: C1#2.2 M1.3(S) M2.2(D) Rds.2 Rds?.1 Rgs?.1
NetCboot_1: Cboot.1 Dboot.1(K) J?.8
NetCboot_2: Cboot.2 J?.6
NetDboot_2: Dboot.2(A) Rboot.1
NetJ?_1: J?.1 ; port From_EPWM
NetJ?_2: J?.2 R?#7.2
NetJ?_4: J?.4 Roff#2.1 Ron#2.1
NetJ?_7: J?.7 Roff#1.1 Ron#1.1
NetM1_1: M1.1(G) Rgs?.2 Ron#1.2 SD?.2(A)
NetM2_1: M2.1(G) Rgs.2 Ron#2.2 SD.2(A)
NetRoff#1_2: Roff#1.2 SD?.1(K)
NetRoff#2_2: Roff#2.2 SD.1(K)

Not connected (* = marked no-connect by the designer): C1#2 1; C2#1 1

### Notes on the sheet
- NEXFET MOSFET
- (near Cby) IC Socket for Driver
- Ohmite Heatsink to be on top of MOSFETS - part not available for placement in schmematic

### Library data of the parts
C1#2 C2#1 = CMP-001-00079-4: Chip Capacitor, 10µF +/-20%, 25V, 0805, Thickness 1.45 mm; Tolerance: 10%; Max Operating Temperature: 85°C; Case/Package: 0805; Voltage Rating: 25V; Min Operating Temperature: -55°C; Mounting Technology: SMT; Pins: 2
Cboot Cby = CMP-001-00001-6: Chip Capacitor, 0.1 uF, +/- 5%, 16 V, 0402 (1005 Metric); Capacitor Type: Ceramic; Voltage Rating: 16V; Max Operating Temperature: 125°C; Min Operating Temperature: -55°C; Case/Package: 0402; Mounting Technology: SM; Pins: 2; Tolerance: 5%; RoHS Compliant: True
Dboot SD SD? = 1N4148B: Diode; Manufacturer_Name: Vishay; Datasheet Link: https://www.vishay.com/docs/81857/1n4148.pdf; Manufacturer_Part_Number: 1N4148B
J? = DILB8P-223TLF: Connector; Manufacturer_Name: Amphenol; Datasheet Link: http://docs-emea.rs-online.com/webdocs/1451/0900766b8145144e.pdf; Height: 5.25mm; Manufacturer_Part_Number: DILB8P-223TLF; Mouser Part Number: 649-DILB8P223TLF; Mouser Price/Stock: https://www.mouser.co.uk/ProductDetail/Amphenol-FCI/DILB8P-223TLF/?qs=gISD9T5QW%2FAiSV%252BbCwW%2Fog%3D%3D; Arrow Part Number: DILB8P-223TLF; Arrow Price/Stock: https://www.arrow.com/en/products/dilb8p-223tlf/amphenol-fci
M1 M2 = IRFB4615PBF: MOSFET (N-Channel); Manufacturer_Name: Infineon; Datasheet Link: https://static6.arrow.com/aropdfconversion/fc085eb00e813bec65c58b34c53aeea1d8b02a1f/irfb4615pbf.pdf; Height: 4.83mm; Manufacturer_Part_Number: IRFB4615PBF; Mouser Part Number: 942-IRFB4615PBF; Mouser Price/Stock: https://www.mouser.co.uk/ProductDetail/Infineon-Technologies/IRFB4615PBF?qs=9%252BKlkBgLFf20BbweusQYXA%3D%3D; Arrow Part Number: IRFB4615PBF; Arrow Price/Stock: https://www.arrow.com/en/products/irfb4615pbf/infineon-technologies-ag
R?#7 Rds Rds? Rgs Rgs? = CMP-009-00149-3: Chip Resistor, 10 kOhms, +/-1 %, 63 mW, -55 to 125 degC, 0402; Power: 63mW; Tolerance: 1%; Min Operating Temperature: -55°C; Case/Package: 0402; Max Operating Temperature: 155°C; Pins: 2
Rboot Roff#1 Roff#2 Ron#1 Ron#2 = CMP-009-00017-5: as R?#1 on sheet Power_Sources; RoHS Compliant: True; Min Operating Temperature: -55°C; Pins: 2; Case/Package: 0603; Mounting Technology: SM; Max Operating Temperature: 155°C; Tolerance: 1%

## Sheet Power_Module.SchDoc
size A
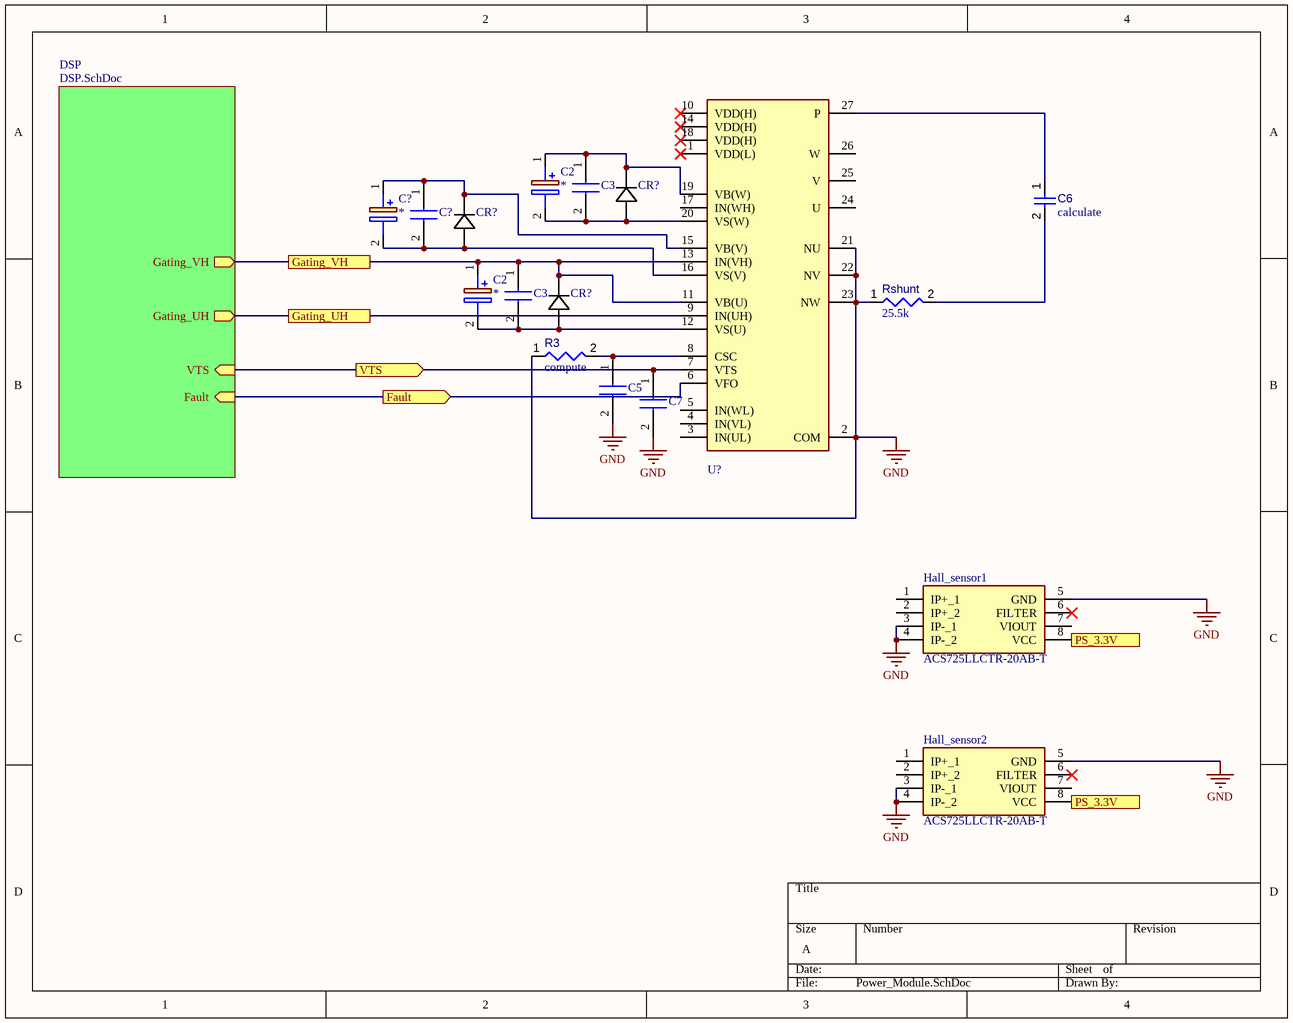
[diagram p6: Power_Module.SchDoc]

### Parts
(Parts that share a designator on the sheet are numbered #1, #2 ... from top to bottom, then left to right.)
C2#2  *  [CAPPRD350W65D800H1650]
C2#3  *  [CAPPRD350W65D800H1650]
C3#1  C340C105K1R5TA  [C340C105K1R5TA]  (value not drawn)
C3#2  C340C105K1R5TA  [C340C105K1R5TA]  (value not drawn)
C5  C340C105K1R5TA  [C340C105K1R5TA]  (value not drawn)
C6  value calculate  [CAPC2013X145X50ML20T25]  (hidden comment: Capacitor 1 uF +/- 10% 25 V 0805)
C7  C340C105K1R5TA  [C340C105K1R5TA]  (value not drawn)
C?#11  *  [CAPPRD350W65D800H1650]
C?#12  C340C105K1R5TA  [C340C105K1R5TA]  (value not drawn)
CR?#1  (no value)  [P6KESeries]
CR?#2  (no value)  [P6KESeries]
CR?#3  (no value)  [P6KESeries]
Hall_sensor1  ACS725LLCTR-20AB-T  [SOT127P600X175-8N]
Hall_sensor2  ACS725LLCTR-20AB-T  [SOT127P600X175-8N]
R3  value compute  [RESC0402(1005)_L]  (hidden comment: Resistor 25K5 +/-1 % 0402 63 mW)
Rshunt  value 25.5k  [RESC0402(1005)_L]  (hidden comment: Resistor 25K5 +/-1 % 0402 63 mW)
U?  FNB34060T  [FNB34060T]  (value not drawn)

### Sub-sheets
DSP = DSP.SchDoc: VTS (in), Fault (in), Gating_UH (out), Gating_VH (out)

### Ports
Fault (out), Gating_UH, Gating_VH, PS_3.3V (in), VTS (out)

### Nets
GND: C5.2 C7.2 Hall_sensor1.3(IP-_1) Hall_sensor1.4(IP-_2) Hall_sensor1.5(GND) Hall_sensor2.3(IP-_1) Hall_sensor2.4(IP-_2) Hall_sensor2.5(GND) R3.1 Rshunt.1 U?.2(COM) U?.21(NU) U?.22(NV) U?.23(NW)  [project net -24V]
NetC2#2_1: C2#2.1(+) C3#1.1 CR?#1.1 U?.19(VB(W))
NetC2#2_2: C2#2.2(-) C3#1.2 CR?#1.2 U?.20(VS(W))
NetC2#3_1: C2#3.1(+) C3#2.1 CR?#3.1 U?.11(VB(U)) U?.13(IN(VH)) ; port Gating_VH, sheet DSP/Gating_VH
NetC2#3_2: C2#3.2(-) C3#2.2 CR?#3.2 U?.12(VS(U))
NetC5_1: C5.1 R3.2 U?.8(CSC)
NetC6_1: C6.1 U?.27(P)
NetC6_2: C6.2 Rshunt.2
NetC7_1: C7.1 U?.7(VTS) ; port VTS, sheet DSP/VTS
NetC?#11_1: C?#11.1(+) C?#12.1 CR?#2.1 U?.15(VB(V))
NetC?#11_2: C?#11.2(-) C?#12.2 CR?#2.2 U?.16(VS(V))
NetHall_sensor1_8: Hall_sensor1.8(VCC) Hall_sensor2.8(VCC) ; port PS_3.3V
NetU?_6: U?.6(VFO) ; port Fault, sheet DSP/Fault
NetU?_9: U?.9(IN(UH)) ; port Gating_UH, sheet DSP/Gating_UH

Not connected (* = marked no-connect by the designer): Hall_sensor1 1(IP+_1) 2(IP+_2) 6(FILTER)* 7(VIOUT); Hall_sensor2 1(IP+_1) 2(IP+_2) 6(FILTER)* 7(VIOUT); U? 1(VDD(L))* 3(IN(UL)) 4(IN(VL)) 5(IN(WL)) 10(VDD(H))* 14(VDD(H))* 17(IN(WH)) 18(VDD(H))* 24(U) 25(V) 26(W)

### Library data of the parts
C2#2 C2#3 C?#11 = EEU-FS2A470: as Cdc1 on sheet Power_Sources; Datasheet Link: https://componentsearchengine.com/Datasheets/1/EEU-FS2A470.pdf; Height: 16.5mm; Manufacturer_Part_Number: EEU-FS2A470; Mouser Part Number: 667-EEU-FS2A470; Mouser Price/Stock: https://www.mouser.co.uk/ProductDetail/Panasonic/EEU-FS2A470?qs=w%2Fv1CP2dgqrDlaRaE647gA%3D%3D; Arrow Part Number: EEU-FS2A470; Arrow Price/Stock: https://www.arrow.com/en/products/eeu-fs2a470/panasonic
C3#1 C3#2 C5 C7 C?#12 = C340C105K1R5TA: Capacitor; Manufacturer_Name: Kemet; Datasheet Link: https://connect.kemet.com:7667/gateway/IntelliData-ComponentDocumentation/1.0/download/specsheet/C340C105K1R5TA; Height: 11.68mm; Manufacturer_Part_Number: C340C105K1R5TA; Mouser Part Number: 80-C340C105K1R; Mouser Price/Stock: https://www.mouser.com/Search/Refine.aspx?Keyword=80-C340C105K1R; Arrow Part Number: C340C105K1R5TA; Arrow Price/Stock: https://www.arrow.com/en/products/c340c105k1r5ta/kemet-corporation
C6 = CMP-001-00010-6: Chip Capacitor, 1 uF, +/-10%, 25 V, 0805 (2012 Metric); Capacitor Type: Ceramic; Voltage Rating: 25V; RoHS Compliant: True; Pins: 2; Mounting Technology: SM; Max Operating Temperature: 125°C; Min Operating Temperature: -55°C; Tolerance: 10%; Case/Package: 0805
CR?#1-CR?#3 = P6KE91A: as CR1 on sheet ee453_pcb_yourname; Manufacturer_Part_Number: P6KE91A; Copyright: Copyright (C) 2018 Accelerated Designs. All rights reserved; RefDes: RefDes; Value: Value
Hall_sensor1 Hall_sensor2 = ACS725LLCTR-20AB-T: Integrated Circuit; Manufacturer_Name: Allegro Microsystems; Datasheet Link: https://www.allegromicro.com/~/media/Files/Datasheets/ACS725-Datasheet.ashx; Height: 1.75mm; Manufacturer_Part_Number: ACS725LLCTR-20AB-T; Arrow Part Number: ACS725LLCTR-20AB-T; Arrow Price/Stock: https://www.arrow.com/en/products/acs725llctr-20ab-t/allegro-microsystems
R3 Rshunt = CMP-009-00171-3: as R?#5 on sheet Boost; Case/Package: 0402; Min Operating Temperature: -55°C; Max Operating Temperature: 155°C; Pins: 2

## Sheet DSP.SchDoc
size A
Used 2 times, as channels Power Module/DSP, DSP - Launchpad. Parts and nets are listed once, with the designators drawn on the sheet.
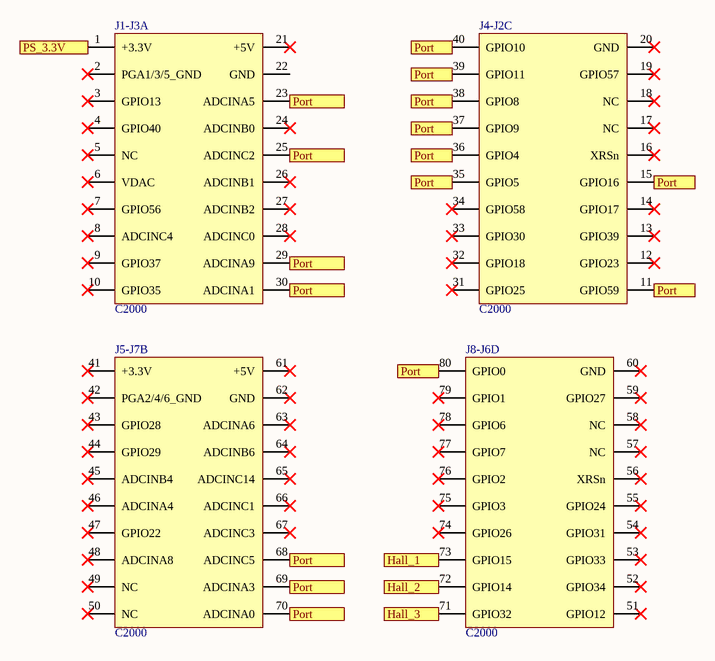
[diagram p7: DSP.SchDoc]

### Parts
J1-J3  C2000  [C2000]  (part A of 4)
J4-J2  C2000  [C2000]  (part C of 4)
J5-J7  C2000  [C2000]  (part B of 4)
J8-J6  C2000  [C2000]  (part D of 4)

### Ports
Hall_1 (in), Hall_2 (in), Hall_3 (in), Port (in), Port (out), PS_3.3V (in)

### Nets
Hall_1: J8-J6.73(GPIO15) ; port Hall_1
Hall_2: J8-J6.72(GPIO14) ; port Hall_2
Hall_3: J8-J6.71(GPIO32) ; port Hall_3
Port: J1-J3.23(ADCINA5) J1-J3.25(ADCINC2) J1-J3.29(ADCINA9) J1-J3.30(ADCINA1) J4-J2.11(GPIO59) J4-J2.15(GPIO16) J4-J2.35(GPIO5) J4-J2.36(GPIO4) J4-J2.37(GPIO9) J4-J2.38(GPIO8) J4-J2.39(GPIO11) J4-J2.40(GPIO10) J5-J7.68(ADCINC5) J5-J7.69(ADCINA3) J5-J7.70(ADCINA0) J8-J6.80(GPIO0) ; port Port
PS_3.3V: J1-J3.1(+3.3V) ; port PS_3.3V

Not connected (* = marked no-connect by the designer): J1-J3 2(PGA1/3/5_GND)* 3(GPIO13)* 4(GPIO40)* 5(NC)* 6(VDAC)* 7(GPIO56)* 8(ADCINC4)* 9(GPIO37)* 10(GPIO35)* 21(+5V)* 22(GND) 24(ADCINB0)* 26(ADCINB1)* 27(ADCINB2)* 28(ADCINC0)*; J4-J2 12(GPIO23)* 13(GPIO39)* 14(GPIO17)* 16(XRSn)* 17(NC)* 18(NC)* 19(GPIO57)* 20(GND)* 31(GPIO25)* 32(GPIO18)* 33(GPIO30)* 34(GPIO58)*; J5-J7 41(+3.3V)* 42(PGA2/4/6_GND)* 43(GPIO28)* 44(GPIO29)* 45(ADCINB4)* 46(ADCINA4)* 47(GPIO22)* 48(ADCINA8)* 49(NC)* 50(NC)* 61(+5V)* 62(GND)* 63(ADCINA6)* 64(ADCINB6)* 65(ADCINC14)* 66(ADCINC1)* 67(ADCINC3)*; J8-J6 51(GPIO12)* 52(GPIO34)* 53(GPIO33)* 54(GPIO31)* 55(GPIO24)* 56(XRSn)* 57(NC)* 58(NC)* 59(GPIO27)* 60(GND)* 74(GPIO26)* 75(GPIO3)* 76(GPIO2)* 77(GPIO7)* 78(GPIO6)* 79(GPIO1)*

### Channels
Power Module/DSP: designators end in _DSP; ports Hall_1=NetJ8-J6_DSP_73 Hall_2=NetJ8-J6_DSP_72 Hall_3=NetJ8-J6_DSP_71 Port=NetJ1-J3_DSP_23 PS_3.3V=NetJ1-J3_DSP_1
DSP - Launchpad: designators end in _DSP_-_Launchpad; ports Hall_1=NetJ8-J6_DSP_-_Launchpad_73 Hall_2=NetJ8-J6_DSP_-_Launchpad_72 Hall_3=NetJ8-J6_DSP_-_Launchpad_71 Port=NetJ1-J3_DSP_-_Launchpad_23 PS_3.3V=NetJ1-J3_DSP_-_Launchpad_1

### Library data of the parts
J1-J3 J4-J2 J5-J7 J8-J6 = C2000: F280049C; Parameter 1: test 2

## Sheet Hall_Sensors.SchDoc
size A

## Sheet levelshifter_page.SchDoc
size A
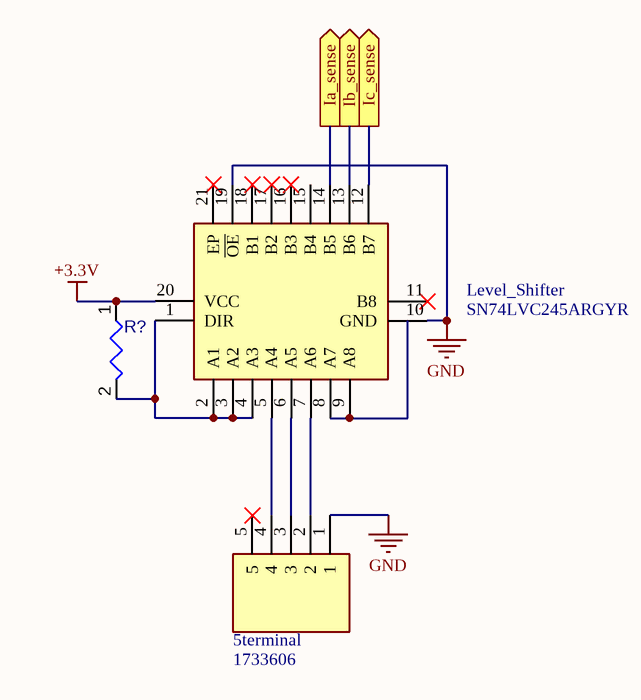
[diagram p8: levelshifter_page.SchDoc]

### Parts
(Parts that share a designator on the sheet are numbered #1, #2 ... from top to bottom, then left to right.)
5terminal  1733606  [1733606]
Level_Shifter  SN74LVC245ARGYR  [SN74LVC541ARGYR]
R?#8  Resistor 25K5 +/-1 % 0402 63 mW  [RESC0402(1005)_L]  (value not drawn)

### Ports
Ia_sense (out), Ib_sense (out), Ic_sense (out)

### Nets
+3.3V: Level_Shifter.20(VCC) R?#8.1
GND: 5terminal.1 Level_Shifter.10(GND) Level_Shifter.19(~{OE})  [project net -24V]
Net5terminal_2: 5terminal.2 Level_Shifter.7(A6)
Net5terminal_3: 5terminal.3 Level_Shifter.6(A5)
Net5terminal_4: 5terminal.4 Level_Shifter.5(A4)
NetLevel_Shifter_1: Level_Shifter.1(DIR) Level_Shifter.2(A1) Level_Shifter.3(A2) Level_Shifter.4(A3) R?#8.2
NetLevel_Shifter_8: Level_Shifter.8(A7) Level_Shifter.9(A8)
NetLevel_Shifter_12: Level_Shifter.12(B7) ; port Ic_sense
NetLevel_Shifter_13: Level_Shifter.13(B6) ; port Ib_sense
NetLevel_Shifter_14: Level_Shifter.14(B5) ; port Ia_sense

Not connected (* = marked no-connect by the designer): 5terminal 5*; Level_Shifter 11(B8)* 15(B4) 16(B3)* 17(B2)* 18(B1)* 21(EP)*

### Library data of the parts
5terminal = 1733606: Connector; Manufacturer_Name: Phoenix Contact; Datasheet Link: https://www.phoenixcontact.com/online/portal/us?uri=pxc-oc-itemdetail:pid=1733606&library=usen&tab=1; Height: 15.45mm; Manufacturer_Part_Number: 1733606; Mouser Part Number: 651-1733606; Mouser Price/Stock: https://www.mouser.co.uk/ProductDetail/Phoenix-Contact/1733606/?qs=coeDwHeOZKnxpzvXWWKBZQ%3D%3D; Arrow Part Number: 1733606; Arrow Price/Stock: https://www.arrow.com/en/products/1733606/phoenix-contact
Level_Shifter = SN74LVC245ARGYR: Integrated Circuit; Manufacturer_Name: Texas Instruments; Datasheet Link: http://www.ti.com/lit/gpn/sn74lvc245a; Height: 1mm; Manufacturer_Part_Number: SN74LVC245ARGYR; Mouser Part Number: 595-SN74LVC245ARGYR; Mouser Price/Stock: https://www.mouser.com/Search/Refine.aspx?Keyword=595-SN74LVC245ARGYR; Arrow Part Number: SN74LVC245ARGYR; Arrow Price/Stock: https://www.arrow.com/en/products/sn74lvc245argyr/texas-instruments
R?#8 = CMP-009-00171-3: as R?#5 on sheet Boost; Case/Package: 0402; Min Operating Temperature: -55°C; Max Operating Temperature: 155°C; Pins: 2

## Nets that join several sheets
+48V: Boost (C?#10.1 D?.1 R?#5.1 RV?.1), Inner_Boost (M1.2 Rds?.2)
-24V: Power_Sources (26 pins), Current_Sensor (C1#1.2 IC?#1.11 IC?#1.14 IC?#1.15), Boost (C?#10.2 D?.2 R?#6.1 RV?.2), Inner_Boost (6 pins), Power_Module (14 pins), levelshifter_page (5terminal.1 Level_Shifter.10 Level_Shifter.19)